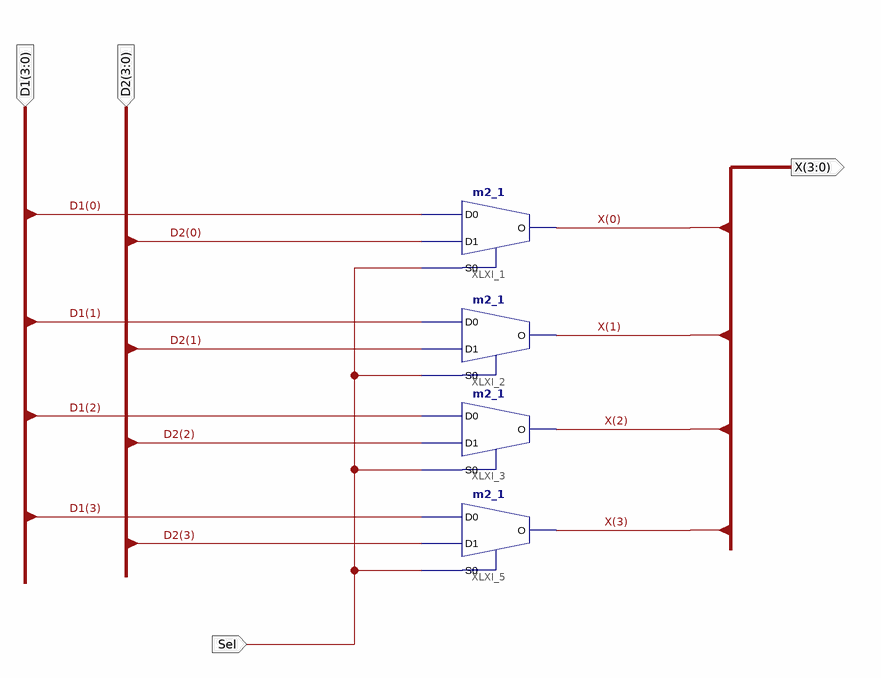
[diagram p0: schematic sheet 1]
// Xilinx ISE schematic MUX2_1.sch (spartan6) as structural Verilog: 4 symbols, 4 ports
module MUX2_1 (
  input  Sel,
  input  [3:0] D1,
  input  [3:0] D2,
  output [3:0] X
);

  m2_1 XLXI_1 (.D0(D1[0]), .D1(D2[0]), .S0(Sel), .O(X[0]));
  m2_1 XLXI_2 (.D0(D1[1]), .D1(D2[1]), .S0(Sel), .O(X[1]));
  m2_1 XLXI_3 (.D0(D1[2]), .D1(D2[2]), .S0(Sel), .O(X[2]));
  m2_1 XLXI_5 (.D0(D1[3]), .D1(D2[3]), .S0(Sel), .O(X[3]));
endmodule
